# EAGLE design talnode (EAGLE 5.12)
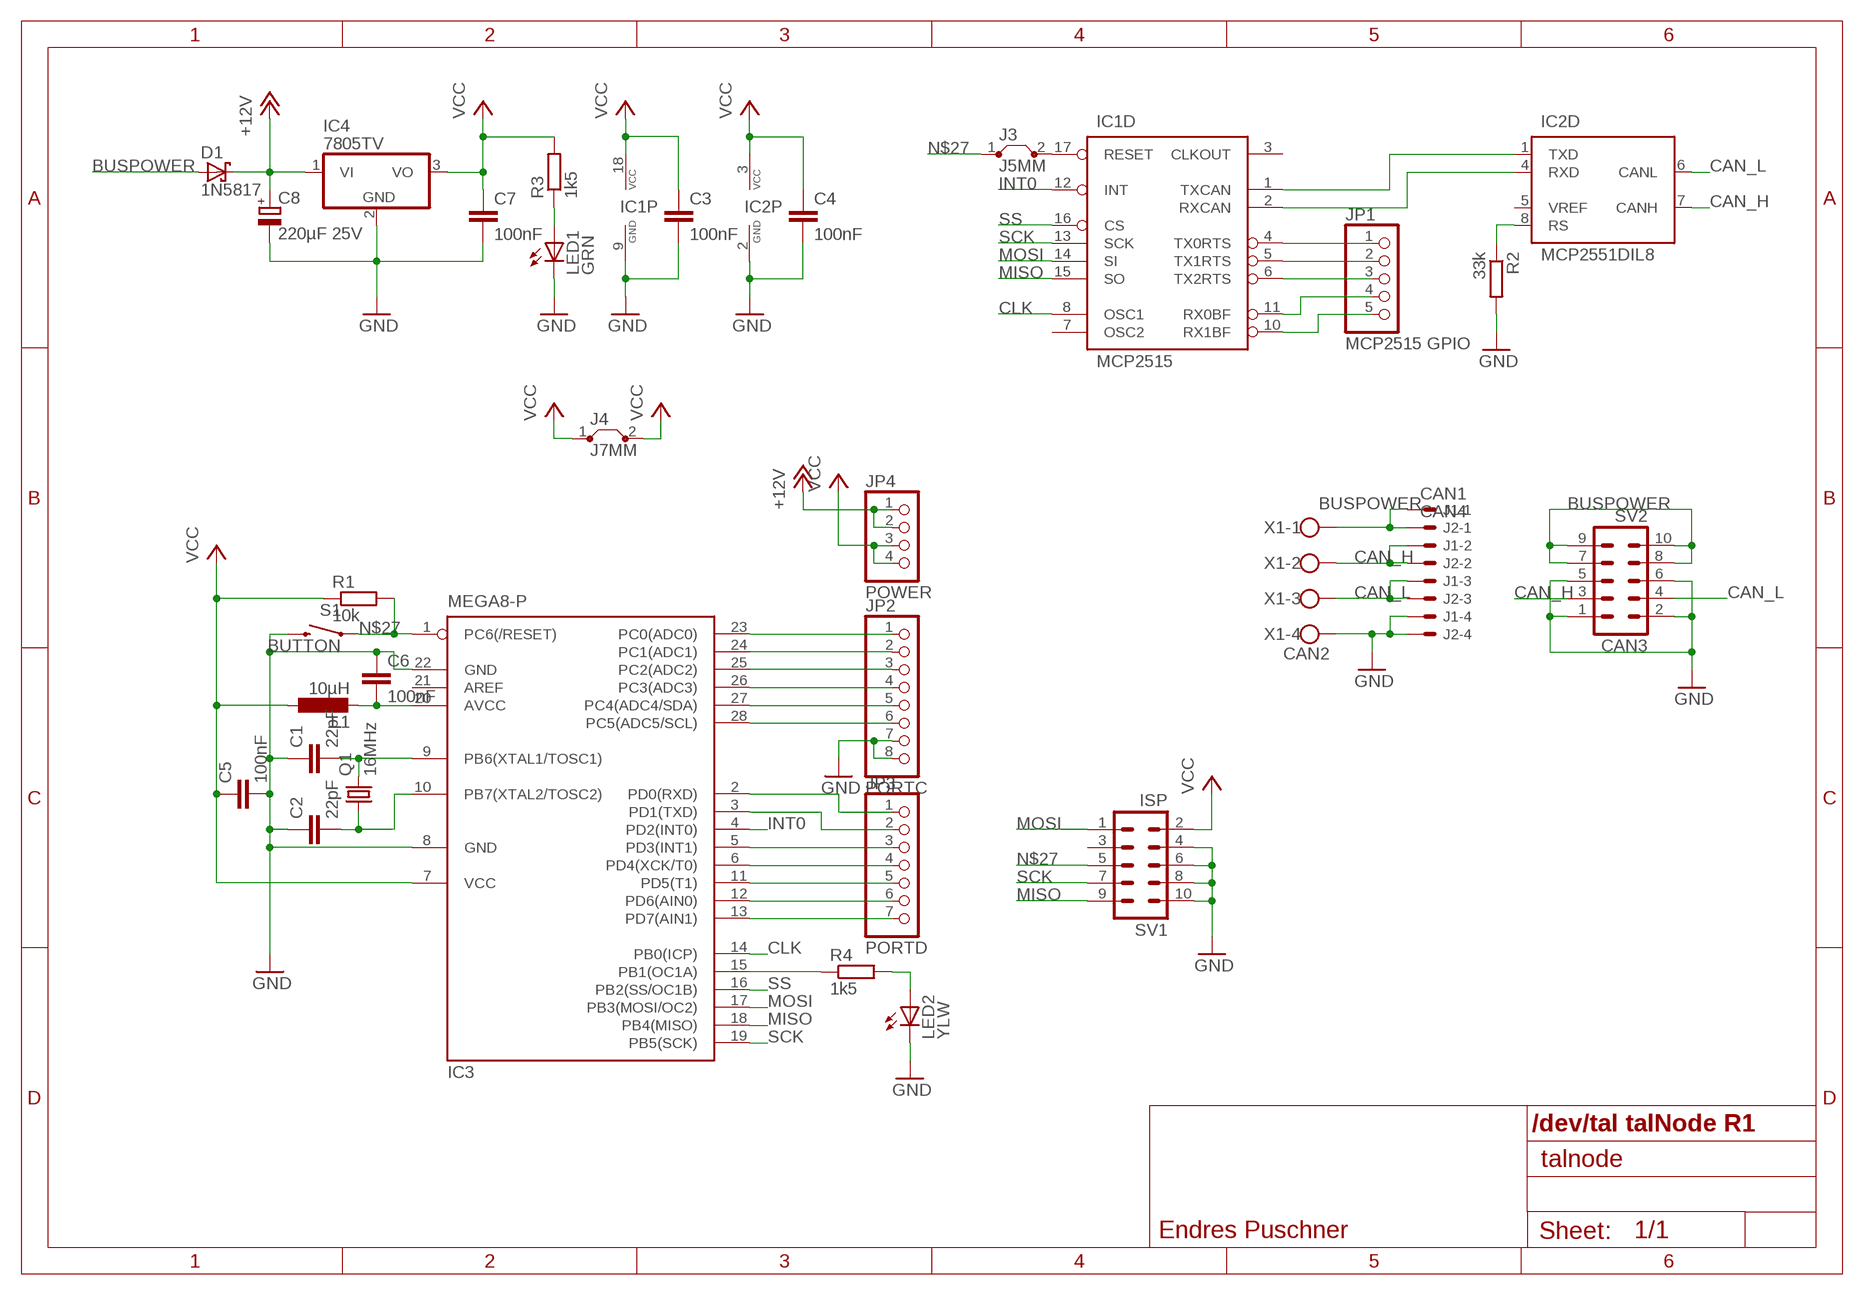
[diagram p0: schematic, sheet 1]

## Parts
C1  22pF  C-EU050-024X044  [C050-024X044]
C2  22pF  C-EU050-024X044  [C050-024X044]
C3  100nF  C-EU025-025X050  [C025-025X050]
C4  100nF  C-EU025-025X050  [C025-025X050]
C5  100nF  C-EU025-025X050  [C025-025X050]
C6  100nF  C-EU025-025X050  [C025-025X050]
C7  100nF  C-EU025-025X050  [C025-025X050]
C8  220µF 25V  CPOL-EUE3.5-8  [E3,5-8]
D1  1N5817  1N5817-T  [DO41-7.6]
IC1  MCP2515  MCP2515P  [DIL18]
IC2  MCP2551DIL8  [DIL08]
IC3  MEGA8-P  [DIL28-3]
IC4  7805TV  [TO220V]
J1  CAN1  22-27-2041-04  [6410-04]
J2  CAN4  22-27-2041-04  [6410-04]
J3  J5MM  [05]
J4  J7MM  [07]
JP1  MCP2515 GPIO  PINHD-1X5  [1X05]
JP2  PORTC  PINHD-1X8  [1X08]
JP3  PORTD  PINHD-1X7  [1X07]
JP4  POWER  PINHD-1X4  [1X04]
L1  10µH  L-EU0207/12  [0207/12]
LED1  GRN  LED3MM  [LED3MM]
LED2  YLW  LED3MM  [LED3MM]
Q1  16MHz  CRYSTALHC49S  [HC49/S]
R1  10k  R-EU_0207/10  [0207/10]
R2  33k  R-EU_0207/10  [0207/10]
R3  1k5  R-EU_0207/10  [0207/10]
R4  1k5  R-EU_0207/10  [0207/10]
S1  BUTTON  SWITCH-MOMENTARY-2PTH  [TACTILE-PTH]
SV1  ISP  ML10  [ML10]
SV2  CAN3  ML10  [ML10]
X1  CAN2  W237-4  [W237-4]

## Nets
+12V: C8.+ D1.C IC4.1(VI) JP4.1 JP4.2
AVCC: C6.2 IC3.20(AVCC) L1.2
BUSPOWER: D1.A J1.1 J2.1 SV2.7 SV2.8 SV2.9 SV2.10 X1.1
CAN_H: IC2.7(D:CANH) J1.2 J2.2 SV2.3 X1.2
CAN_L: IC2.6(D:CANL) J1.3 J2.3 SV2.4 X1.3
CLK: IC1.8(D:OSC1) IC3.14(PB0(ICP))
GND: C1.1 C2.1 C3.2 C4.2 C5.2 C6.1 C7.2 C8.- IC1.9(P:GND) IC2.2(P:GND) IC3.8(GND) IC3.22(GND) IC4.2(GND) J1.4 J2.4 JP2.7 JP2.8 LED1.K(C) LED2.K(C) R2.2 S1.3 SV1.4 SV1.6 SV1.8 SV1.10 SV2.1 SV2.2 SV2.5 SV2.6 X1.4
INT0: IC1.12(D:INT) IC3.4(PD2(INT0))
MISO: IC1.15(D:SO) IC3.18(PB4(MISO)) SV1.9
MOSI: IC1.14(D:SI) IC3.17(PB3(MOSI/OC2)) SV1.1
N$1: IC3.23(PC0(ADC0)) JP2.1
N$2: IC1.17(D:RESET) J3.2
N$3: IC2.8(D:RS) R2.1
N$4: IC3.24(PC1(ADC1)) JP2.2
N$5: IC3.26(PC3(ADC3)) JP2.4
N$6: IC1.1(D:TXCAN) IC2.1(D:TXD)
N$7: IC1.2(D:RXCAN) IC2.4(D:RXD)
N$8: IC1.11(D:RX0BF) JP1.4
N$9: IC1.10(D:RX1BF) JP1.5
N$10: IC1.4(D:TX0RTS) JP1.1
N$11: IC1.5(D:TX1RTS) JP1.2
N$12: IC1.6(D:TX2RTS) JP1.3
N$13: IC3.25(PC2(ADC2)) JP2.3
N$14: IC3.27(PC4(ADC4/SDA)) JP2.5
N$15: IC3.28(PC5(ADC5/SCL)) JP2.6
N$16: IC3.2(PD0(RXD)) JP3.1
N$17: IC3.3(PD1(TXD)) JP3.2
N$18: IC3.5(PD3(INT1)) JP3.3
N$19: IC3.6(PD4(XCK/T0)) JP3.4
N$20: IC3.11(PD5(T1)) JP3.5
N$21: IC3.12(PD6(AIN0)) JP3.6
N$22: IC3.13(PD7(AIN1)) JP3.7
N$23: IC3.15(PB1(OC1A)) R4.1
N$24: LED1.A R3.1
N$25: LED2.A R4.2
N$27: IC3.1(PC6(/RESET)) J3.1 R1.2 S1.1 SV1.5
OSC1: C1.2 IC3.9(PB6(XTAL1/TOSC1)) Q1.2
OSC2: C2.2 IC3.10(PB7(XTAL2/TOSC2)) Q1.1
SCK: IC1.13(D:SCK) IC3.19(PB5(SCK)) SV1.7
SS: IC1.16(D:CS) IC3.16(PB2(SS/OC1B))
VCC: C3.1 C4.1 C5.1 C7.1 IC1.18(P:VCC) IC2.3(P:VCC) IC3.7(VCC) IC4.3(VO) J4.1 J4.2 JP4.3 JP4.4 L1.1 R1.1 R3.2 SV1.2
Unconnected: IC1.3(D:CLKOUT) IC1.7(D:OSC2) IC2.5(D:VREF) IC3.21(AREF) SV1.3

## Notes on the sheet
- /dev/tal talNode R1
- Endres Puschner

## Library data of the parts
C1-C7 = resistor:C-EU: CAPACITOR, European symbol
C8 = resistor:CPOL-EU: POLARIZED CAPACITOR, European symbol
D1 = diode:1N581*: 1.0A SCHOTTKY BARRIER RECTIFIER Source: http://www.diodes.com/datasheets/ds23001.pdf
IC1 = can:MCP2515: MC2515 Stand-Alone CAN Controller With SPI Interface, Microchip
IC2 = can:MCP2551: CAN Tranceiver Microchip
IC3 = atmel:MEGA8-P: MICROCONTROLLER 8 Kbytes FLASH, 1 kbytes SRAM, 512 bytes EEPROM, USART, 4-channel 10 bit ADC, 2-channel 8 bit ADC Pin compatible with Atmega48, ATMega88, ATMega168 Source: avr.lbr; OC_FARNELL: unknown; OC_NEWARK: unknown
IC4 = linear:78*: Positive VOLTAGE REGULATOR Source: http://cache.national.com/ds/LM/LM78L05.pdf http://www.fairchildsemi.com/ds/LM/LM7805.pdf
J1 J2 = con-molex:22-?-04: CONNECTOR wire to board 2.54 mm (.1 inch) pitch header; OC_FARNELL: unknown; OC_NEWARK: unknown
J3 J4 = jumper:J: Bridge
JP1 = pinhead:PINHD-1X5: PIN HEADER
JP2 = pinhead:PINHD-1X8: PIN HEADER
JP3 = pinhead:PINHD-1X7: PIN HEADER
JP4 = pinhead:PINHD-1X4: PIN HEADER
L1 = resistor:L-EU: INDUCTOR, European symbol
LED1 LED2 = led:LED: LED OSRAM: - CHIPLED LG R971, LG N971, LY N971, LG Q971, LY Q971, LO R971, LY R971 LH N974, LH R974 LS Q976, LO Q976, LY Q976 LO Q996 - Hyper CHIPLED LW Q18S LB Q993, LB Q99A, LB R99A - SideLED LS A670, LO A670, LY A670, LG A670, LP A670 LB A673, LV A673, LT A673, LW A673 LH A674 LY A675 LS A676, LA A676, LO A676, LY A676, LW A676 LS A679, LY A679, LG A679 - Hyper Micro SIDELED® LS Y876, LA Y876, LO Y876, LY Y876 LT Y87S - SmartLED LW L88C, LW L88S LB L89C, LB L89S, LG L890 LS L89K, LO L89K, LY L89K LS L896, LA L896, LO L896, LY L896 - TOPLED LS T670, LO T670, LY T670, LG T670, LP T670 LSG T670, LSP T670, LSY T670, LOP T670, LYG T670 LG T671, LOG T671, LSG T671 LB T673, LV T673, LT T673, LW T673 LH T674 LS T676, LA T676, LO T676, LY T676, LB T676, LH T676, LSB T676, LW T676 LB T67C, LV T67C, LT T67C, LS T67K, LO T67K, LY T67K, LW E67C LS E67B, LA E67B, LO E67B, LY E67B, LB E67C, LV E67C, LT E67C LW T67C LS T679, LY T679, LG T679 LS T770, LO T770, LY T770, LG T770, LP T770 LB T773, LV T773, LT T773, LW T773 LH T774 LS E675, LA E675, LY E675, LS T675 LS T776, LA T776, LO T776, LY T776, LB T776 LHGB T686 LT T68C, LB T68C - Hyper Mini TOPLED® LB M676 - Mini TOPLED Santana® LG M470 LS M47K, LO M47K, LY M47K Source: http://www.osram.convergy.de LUXEON: - LUMILED® LXK2-PW12-R00, LXK2-PW12-S00, LXK2-PW14-U00, LXK2-PW14-V00 LXK2-PM12-R00, LXK2-PM12-S00, LXK2-PM14-U00 LXK2-PE12-Q00, LXK2-PE12-R00, LXK2-PE12-S00, LXK2-PE14-T00, LXK2-PE14-U00 LXK2-PB12-K00, LXK2-PB12-L00, LXK2-PB12-M00, LXK2-PB14-N00, LXK2-PB14-P00, LXK2-PB14-Q00 LXK2-PR12-L00, LXK2-PR12-M00, LXK2-PR14-Q00, LXK2-PR14-R00 LXK2-PD12-Q00, LXK2-PD12-R00, LXK2-PD12-S00 LXK2-PH12-R00, LXK2-PH12-S00 LXK2-PL12-P00, LXK2-PL12-Q00, LXK2-PL12-R00 Source: www.luxeon.com KINGBRIGHT: KA-3528ASYC Source: www.kingbright.com
Q1 = crystal:CRYSTAL: CRYSTAL; OC_FARNELL: 1667008; OC_NEWARK: unknown
R1-R4 = resistor:R-EU_: RESISTOR, European symbol
S1 = SparkFun_eagle5:SWITCH-MOMENTARY-2
SV1 SV2 = con-ml:ML10: HARTING; OC_FARNELL: unknown; OC_NEWARK: unknown
X1 = con-wago-500:W237-4: WAGO SCREW CLAMP; OC_FARNELL: unknown; OC_NEWARK: unknown

## Board
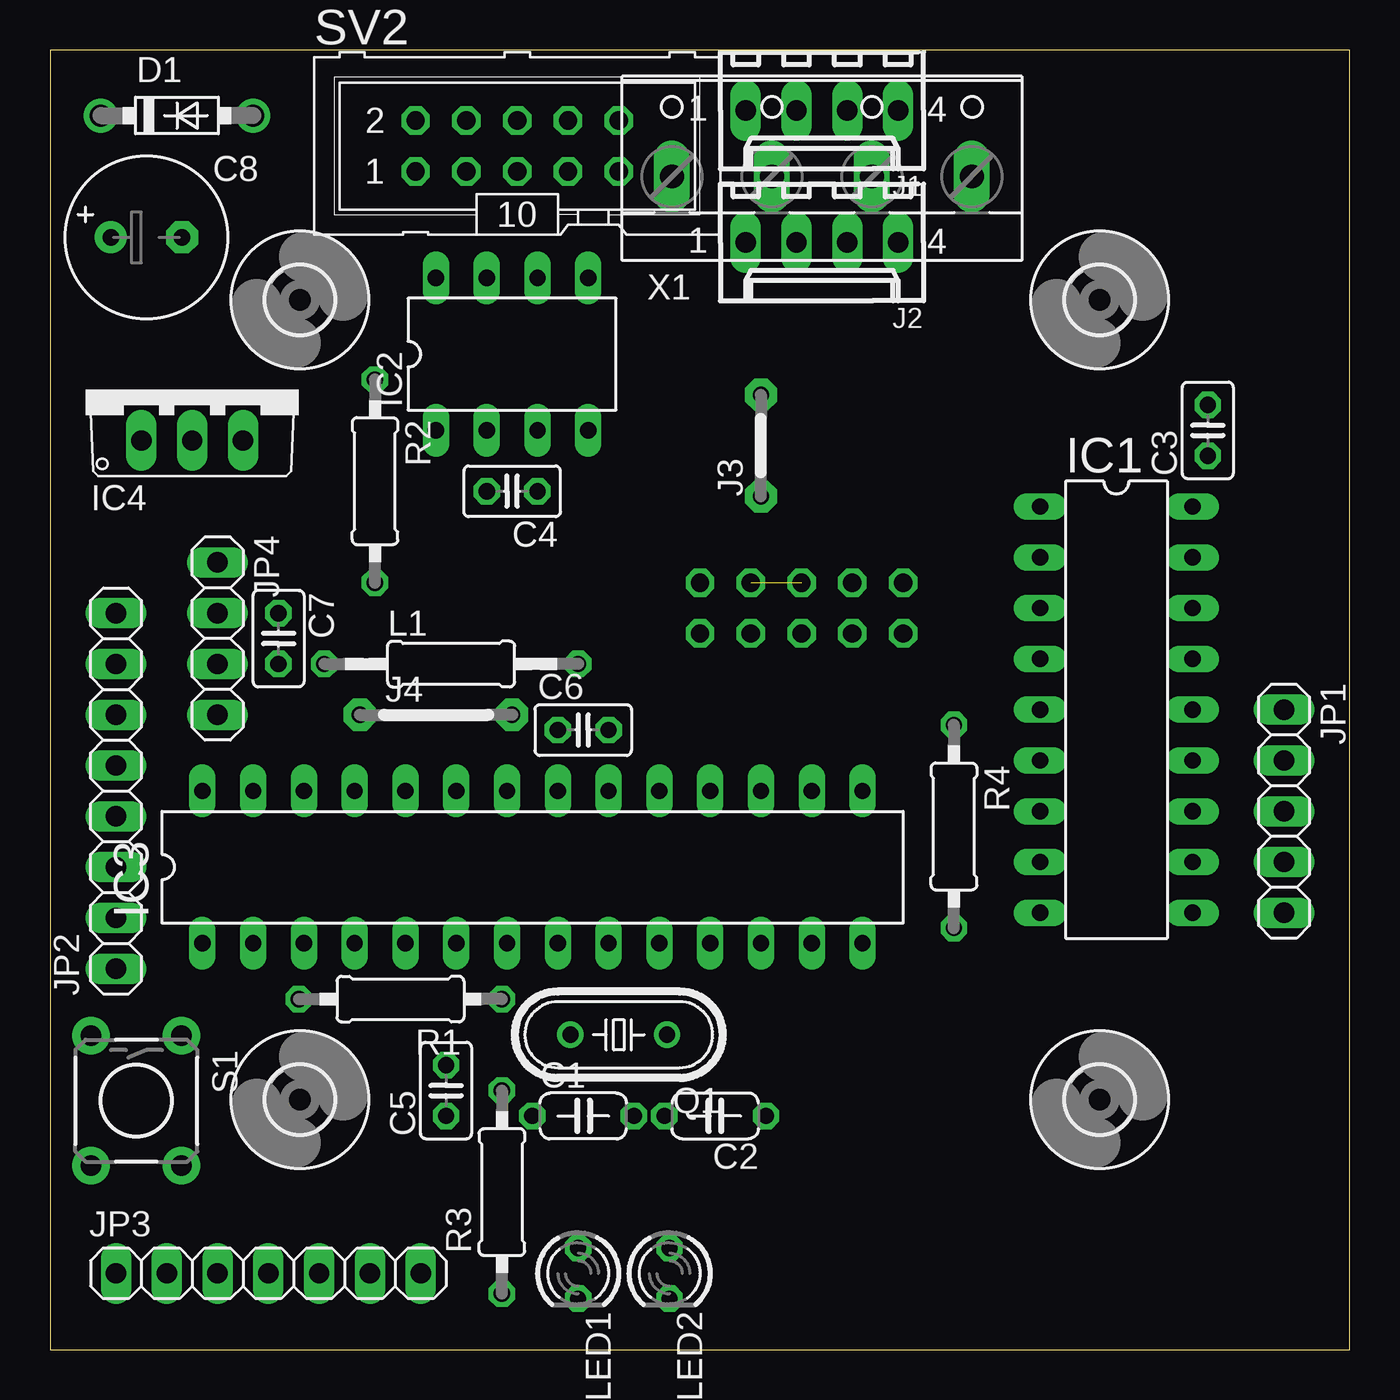
[diagram p1: board, top side]
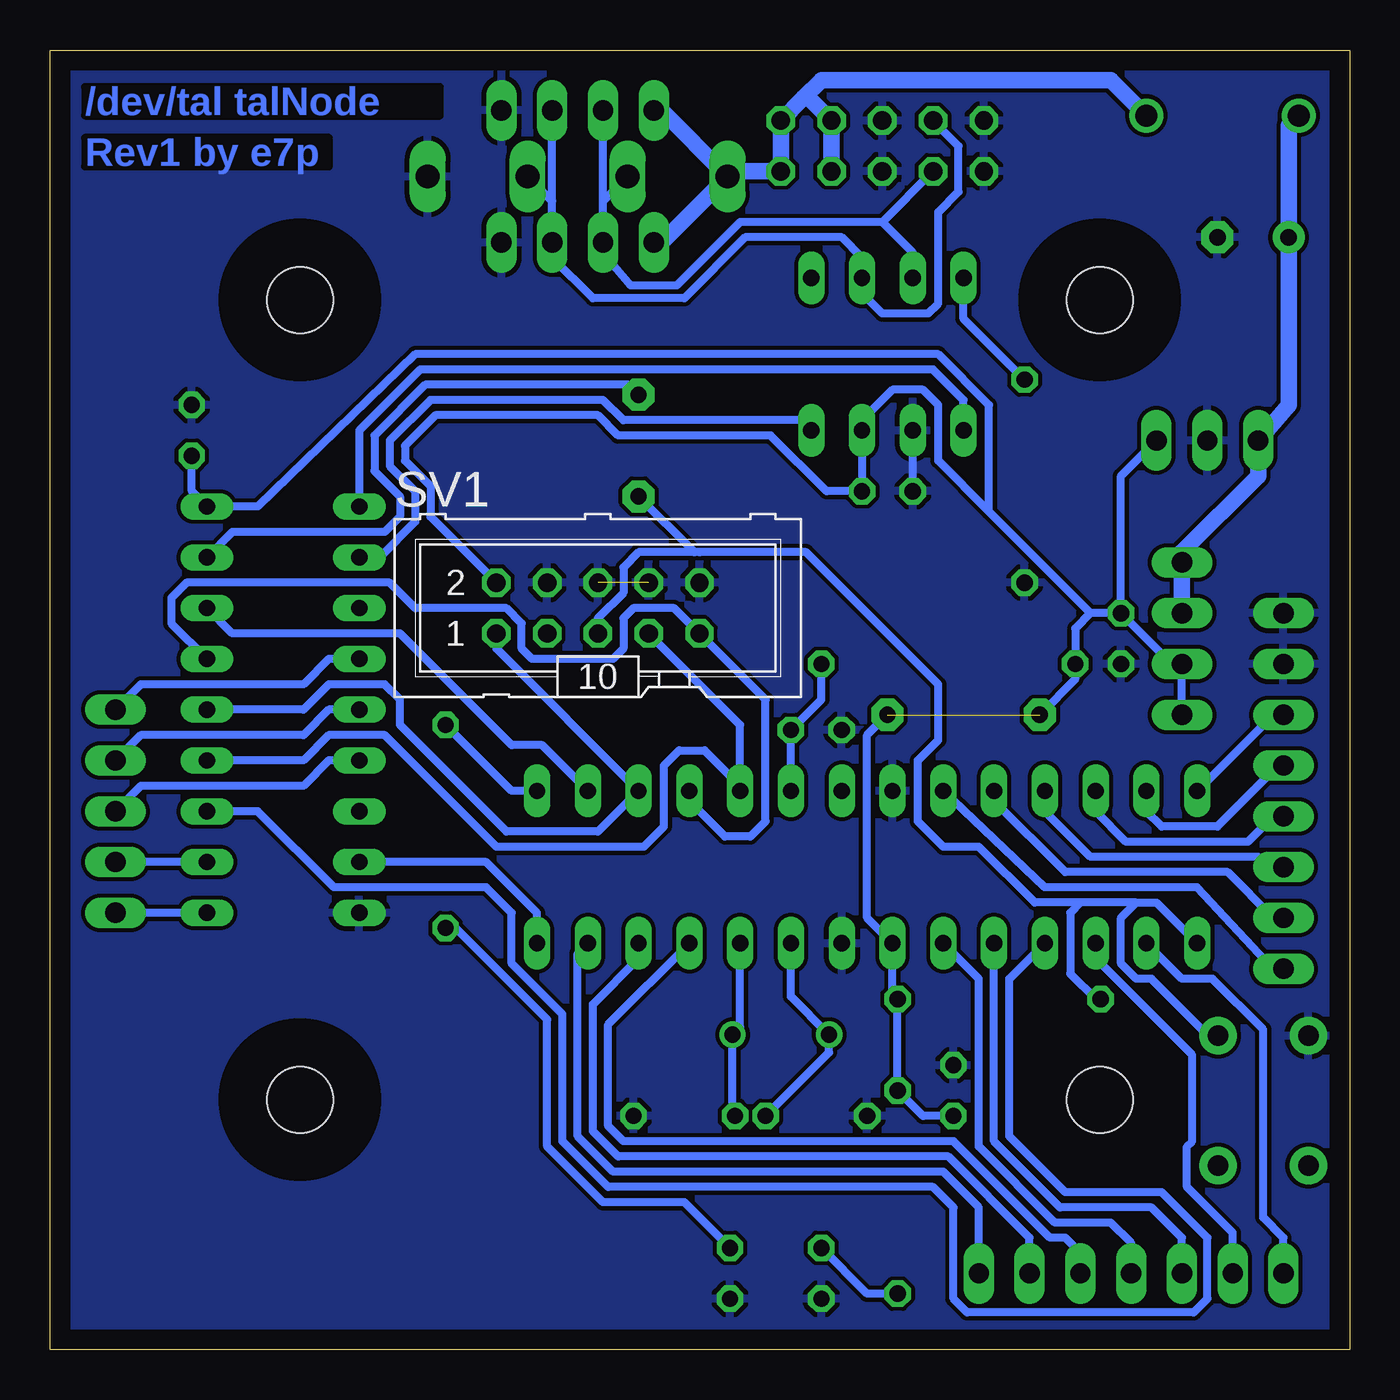
[diagram p2: board, bottom side, seen from below]

Size 65 x 65 mm. Coordinates in mm from the lower left corner, seen from the top.
Outline: 0,0 65,0 65,65 0,65 0,0
Copper layers (1*16): Top 0.035mm / dielectric 1.5mm / Bottom 0.035mm
Design rules "default": minimum track width 10mil, minimum drill 24mil, track to track 8mil, track to pad 8mil, pad to pad 8mil, via to via 8mil, smd to smd 8mil, copper to edge 40mil, drill to drill 8mil, minimum pad ring 10mil, minimum via ring 8mil, stop-mask expansion 4mil, vias tented up to drill 0mil, thermal gap 10mil
Milling: 4 lines

### Footprints (pad centres in the part's own frame; a part is rotated, then mirrored left to right if it is on the bottom)
C050-024X044 = drill 0.813 octagon: 1 -2.54,0; 2 2.54,0
C025-025X050 = drill 0.813 octagon: 1 -1.27,0; 2 1.27,0
E3,5-8 = drill 0.813 pad 1.6 round: + -1.778,0 | drill 0.813 pad 1.6 octagon: - 1.778,0
DO41-7.6 = drill 1.1 pad 1.7 round: A 3.81,0; C -3.81,0
DIL18 = drill 0.813 long: 1 -10.16,-3.81; 2 -7.62,-3.81; 3 -5.08,-3.81; 4 -2.54,-3.81; 5 0,-3.81; 6 2.54,-3.81; 7 5.08,-3.81; 8 7.62,-3.81; 9 10.16,-3.81; 10 10.16,3.81; 11 7.62,3.81; 12 5.08,3.81; 13 2.54,3.81; 14 0,3.81; 15 -2.54,3.81; 16 -5.08,3.81; 17 -7.62,3.81; 18 -10.16,3.81
DIL08 = drill 0.813 long: 1 -3.81,-3.81; 2 -1.27,-3.81; 3 1.27,-3.81; 4 3.81,-3.81; 5 3.81,3.81; 6 1.27,3.81; 7 -1.27,3.81; 8 -3.81,3.81
DIL28-3 = drill 0.813 long: 1 -16.51,-3.81; 2 -13.97,-3.81; 3 -11.43,-3.81; 4 -8.89,-3.81; 5 -6.35,-3.81; 6 -3.81,-3.81; 7 -1.27,-3.81; 8 1.27,-3.81; 9 3.81,-3.81; 10 6.35,-3.81; 11 8.89,-3.81; 12 11.43,-3.81; 13 13.97,-3.81; 14 16.51,-3.81; 15 16.51,3.81; 16 13.97,3.81; 17 11.43,3.81; 18 8.89,3.81; 19 6.35,3.81; 20 3.81,3.81; 21 1.27,3.81; 22 -1.27,3.81; 23 -3.81,3.81; 24 -6.35,3.81; 25 -8.89,3.81; 26 -11.43,3.81; 27 -13.97,3.81; 28 -16.51,3.81
TO220V = drill 1.016 long: 1 -2.54,-2.54; 2 0,-2.54; 3 2.54,-2.54
6410-04 = drill 1.016 long: 1 3.81,0; 2 1.27,0; 3 -1.27,0; 4 -3.81,0
05 = drill 0.813 pad 1.6 octagon: 1 -2.54,0; 2 2.54,0
07 = drill 0.813 pad 1.6 octagon: 1 -3.81,0; 2 3.81,0
1X05 = drill 1.016 long: 1 -5.08,0; 2 -2.54,0; 3 0,0; 4 2.54,0; 5 5.08,0
1X08 = drill 1.016 long: 1 -8.89,0; 2 -6.35,0; 3 -3.81,0; 4 -1.27,0; 5 1.27,0; 6 3.81,0; 7 6.35,0; 8 8.89,0
1X07 = drill 1.016 long: 1 -7.62,0; 2 -5.08,0; 3 -2.54,0; 4 0,0; 5 2.54,0; 6 5.08,0; 7 7.62,0
1X04 = drill 1.016 long: 1 -3.81,0; 2 -1.27,0; 3 1.27,0; 4 3.81,0
0207/12 = drill 0.813 octagon: 1 -6.35,0; 2 6.35,0
LED3MM = drill 0.813 octagon: A -1.27,0; K 1.27,0
HC49/S = drill 0.813 round: 1 -2.413,0; 2 2.413,0
0207/10 = drill 0.813 octagon: 1 -5.08,0; 2 5.08,0
TACTILE-PTH = drill 1.016 pad 1.88 round: 1 -3.251,2.261; 2 3.251,2.261; 3 -3.251,-2.261; 4 3.251,-2.261
ML10 = drill 0.914 octagon: 1 -5.08,-1.27; 2 -5.08,1.27; 3 -2.54,-1.27; 4 -2.54,1.27; 5 0,-1.27; 6 0,1.27; 7 2.54,-1.27; 8 2.54,1.27; 9 5.08,-1.27; 10 5.08,1.27
3,3 = hole 3.3: 0,0
W237-4 = drill 1.194 long: 1 -7.5,-1.27; 2 -2.5,-1.27; 3 2.5,-1.27; 4 7.5,-1.27

### Placement (x,y rotation side)
C1  26.67,11.68 0 top
C2  33.27,11.68 180 top
C3  57.91,45.97 90 top
C4  23.11,42.93 180 top
C5  19.81,12.95 90 top
C6  26.67,30.99 0 top
C7  11.43,35.56 270 top
C8  4.83,55.63 0 top
D1  6.35,61.72 0 top
IC1  53.34,32 270 top
IC2  23.11,49.78 0 top
IC3  24.13,24.13 0 top
IC4  7.11,48.01 0 top
J1  38.61,61.98 180 top
J2  38.61,55.37 180 top
J3  35.56,45.21 90 top
J4  19.3,31.75 0 top
JP1  61.72,26.92 270 top
JP2  3.3,27.94 90 top
JP3  10.92,3.81 0 top
JP4  8.38,35.56 270 top
L1  20.07,34.29 0 top
LED1  26.42,3.81 270 top
LED2  30.99,3.81 270 top
Q1  28.45,15.75 180 top
R1  17.53,17.53 180 top
R2  16.26,43.43 270 top
R3  22.61,7.87 90 top
R4  45.21,26.16 270 top
S1  4.32,12.45 270 top
SV1  37.59,37.08 0 bottom
SV2  23.37,60.2 0 top
U$1  [3,3]  12.5,52.5 0 top
U$2  [3,3]  52.5,52.5 0 top
U$3  [3,3]  12.5,12.5 0 top
U$4  [3,3]  52.5,12.5 0 top
X1  38.61,59.94 0 top

### Tracks (layer width: path | path; a pad name or v marks a point on that pad's centre or on a via)
+12V
  Bottom 0.813: D1.C 3.05,61.21 C8.+ 3.05,47.24 IC4.1 4.57,43.69 8.38,39.88 JP4.1 JP4.2
AVCC
  Bottom 0.406: L1.2 26.42,32.51 C6.2 IC3.20
BUSPOWER
  Bottom 0.813: X1.1 34.41,61.98 J1.1 | X1.1 34.41,55.37 J2.1 | X1.1 30.85,58.93 SV2.9 SV2.10 27.3,62.61 | SV2.7 SV2.8 27.05,62.61 27.3,62.61 | 27.3,62.61 26.42,63.5 11.94,63.5 D1.A
CAN_H
  Bottom 0.406: 37.34,57.44 X1.2 | 37.34,57.44 J2.2 37.34,54.86 35.94,53.21 33.66,53.21 30.48,56.39 23.37,56.39 | 37.34,57.44 J1.2 | 23.37,56.39 SV2.3 | IC2.7 21.84,54.86 23.37,56.39
CAN_L
  Bottom 0.406: 39.88,57.44 X1.3 | 39.88,57.44 J2.3 39.88,54.61 37.85,52.58 33.27,52.58 30.23,55.63 25.4,55.63 24.38,54.61 IC2.6 24.38,52.83 23.37,51.82 21.08,51.82 20.57,52.32 20.57,56.9 19.56,57.91 19.56,60.2 SV2.4 | 39.88,57.44 J1.3
CLK
  Bottom 0.406: IC1.8 43.18,24.38 40.64,21.84 IC3.14
GND  (1 unrouted)
  Bottom 0.406: C4.2 IC2.2
  pour Bottom: 0,0 0,65.02 65.02,65.02 65.02,0
INT0
  Bottom 0.406: IC3.4 17.02,18.54 17.02,10.67 14.22,7.87 9.4,7.87 7.11,5.59 7.11,2.54 7.8,1.85 19.13,1.85 19.81,2.54 19.81,7.11 20.83,8.13 37.08,8.13 39.37,10.41 39.37,16.76 41.91,19.3 41.91,21.84 43.18,23.11 50.8,23.11 54.61,26.92 IC1.12
MISO
  Bottom 0.406: IC1.15 58.93,36.32 58.93,37.59 58.17,38.35 48.01,38.35 46.74,37.08 42.16,37.08 41.4,36.32 41.4,35.05 40.89,34.54 36.83,34.54 36.32,35.05 36.32,36.58 35.81,37.08 33.78,37.08 SV1.9 29.21,32.51 29.21,26.42 29.97,25.65 31.24,25.65 33.02,27.43 IC3.18
MOSI
  Bottom 0.406: IC1.14 52.32,32 51.05,33.27 48.26,33.27 47.5,32.51 47.5,31.24 42.16,25.91 37.59,25.91 IC3.17 42.67,35.05 SV1.1
N$1
  Bottom 0.406: IC3.23 15.24,23.11 7.62,23.11 3.81,19.05 JP2.1
N$2
  Bottom 0.406: J3.2 36.07,48.26 46.23,48.26 48.77,45.72 48.77,43.94 47.5,42.67 47.5,41.66 48.26,40.89 55.88,40.89 IC1.17
N$3
  Bottom 0.406: R2.1 19.3,51.56 IC2.8
N$4
  Bottom 0.406: IC3.24 17.78,27.43 14.22,23.88 6.1,23.88 3.81,21.59 JP2.2
N$5
  Bottom 0.406: IC3.26 12.7,26.92 11.18,25.4 5.08,25.4 3.81,26.67 JP2.4
N$6
  Bottom 0.406: IC1.1 49.53,45.97 46.48,49.02 20.83,49.02 19.3,47.5 IC2.1
N$7
  Bottom 0.406: IC1.2 48.51,39.62 46.74,41.4 46.74,42.93 48.01,44.2 48.01,45.47 45.97,47.5 37.34,47.5 36.32,46.48 27.43,46.48 IC2.4
N$8
  Bottom 0.406: IC1.11 JP1.4
N$9
  Bottom 0.406: IC1.10 JP1.5
N$10
  Bottom 0.406: IC1.4 51.05,34.54 52.32,33.27 60.45,33.27 JP1.1
N$11
  Bottom 0.406: IC1.5 51.05,32 52.32,30.73 60.45,30.73 JP1.2
N$12
  Bottom 0.406: IC1.6 51.05,29.46 52.32,28.19 60.45,28.19 JP1.3
N$13
  Bottom 0.406: IC3.25 15.24,26.92 12.95,24.64 4.57,24.64 4.06,24.13 JP2.3
N$14
  Bottom 0.406: IC3.27 10.16,26.92 9.4,26.16 6.6,26.16 3.56,29.21 JP2.5
N$15
  Bottom 0.406: IC3.28 3.81,31.75 JP2.6
N$16
  Bottom 0.406: IC3.2 8.38,18.54 6.86,18.54 4.32,16 4.32,6.6 3.3,5.59 JP3.1
N$17
  Bottom 0.406: IC3.3 12.7,19.56 7.87,14.73 7.87,10.41 8.13,10.16 8.13,8.13 5.84,5.84 JP3.2
N$18
  Bottom 0.406: IC3.5 17.78,10.41 14.48,7.11 9.91,7.11 8.38,5.59 JP3.3
N$19
  Bottom 0.406: IC3.6 18.54,18.54 18.54,10.16 14.73,6.35 11.94,6.35 10.92,5.33 JP3.4
N$20
  Bottom 0.406: IC3.11 37.08,16.26 37.08,11.18 36.32,10.41 19.81,10.41 14.99,5.59 14.22,5.59 13.46,4.83 JP3.5
N$21
  Bottom 0.406: IC3.12 35.56,19.56 37.85,17.27 37.85,10.92 36.58,9.65 20.07,9.65 16,5.59 JP3.6
N$22
  Bottom 0.406: IC3.13 38.61,19.81 38.61,10.67 36.83,8.89 20.32,8.89 18.54,7.11 JP3.7
N$23
  Bottom 0.406: R4.1 41.91,27.94 IC3.15
N$24
  Bottom 0.406: LED1.A 24.13,2.79 R3.1
N$25
  Bottom 0.406: LED2.A 33.27,7.37 37.34,7.37 40.13,10.16 40.13,16.51 44.7,21.08 R4.2
N$27
  Bottom 0.406: R1.2 12.7,17.53 13.97,18.8 13.97,21.84 13.46,22.35 | 10.67,22.35 13.46,22.35 | 10.67,22.35 9.65,22.35 IC3.1 | 13.46,22.35 15.75,22.35 18.54,25.15 20.32,25.15 21.59,26.42 21.59,29.46 20.57,30.48 20.57,33.27 27.18,39.88 32.51,39.88 32.77,39.88 | 32.77,39.88 35.56,39.88 36.32,39.12 36.32,37.85 37.59,36.58 SV1.5 | 10.67,22.35 11.43,21.59 11.43,19.3 10.67,18.54 9.91,18.54 7.11,15.75 6.6,15.75 6.58,15.72 S1.1 | 32.77,39.88 J3.1
OSC1
  Bottom 0.406: IC3.9 27.94,17.65 Q1.2 26.04,14.86 C1.2
OSC2
  Bottom 0.406: IC3.10 30.48,16.13 Q1.1 30.86,11.81 C2.2
SCK
  Bottom 0.406: IC1.13 52.32,29.46 51.05,30.73 48.26,30.73 42.67,25.15 35.31,25.15 34.29,26.16 34.29,29.21 33.53,29.97 32.26,29.97 30.48,28.19 | SV1.7 30.48,31.24 30.48,28.19 | 30.48,28.19 IC3.19
SS
  Bottom 0.406: IC1.16 55.88,35.81 48.26,35.81 48.01,35.81 47.5,35.81 41.91,30.23 40.39,30.23 IC3.16
VCC  (1 unrouted)
  Bottom 0.406: C3.1 57.91,42.93 IC1.18 54.61,42.16 46.74,49.78 20.57,49.78 18.03,47.24 18.03,41.91 | SV1.2 45.97,41.66 45.97,43.18 47.24,44.45 47.24,45.21 45.72,46.74 37.59,46.74 36.58,45.72 28.96,45.72 26.16,42.93 C4.1 IC2.3 24.38,46.48 22.86,48.01 21.34,48.01 20.57,47.24 20.57,44.45 18.03,41.91 | C5.1 21.34,11.68 R3.2 R1.1 22.86,17.78 IC3.7 24.13,21.59 24.13,30.73 J4.2 | 12.95,36.83 18.03,41.91 | C7.1 12.95,36.83 | 12.95,36.83 13.72,36.07 L1.1 13.72,33.53 J4.1 | IC4.3 11.43,43.69 C7.1 | JP4.4 JP4.3 8.89,34.29 C7.1

### Text on the board
Bottom: /dev/tal talNode | Rev1 by e7p